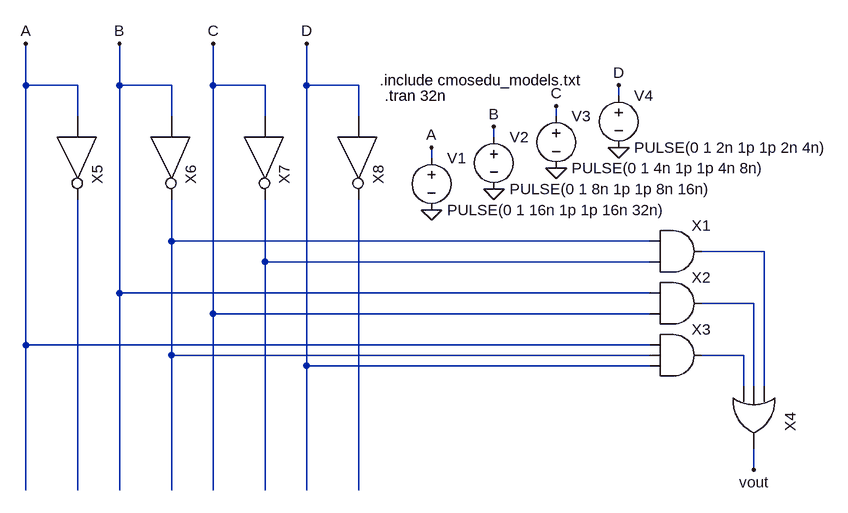
[diagram p0: schematic circuit.asc]
circuit.asc, the LTspice schematic file:
Version 4
SHEET 1 1092 680
WIRE -528 -64 -528 -128
WIRE -448 -64 -528 -64
WIRE -384 -64 -384 -128
WIRE -304 -64 -384 -64
WIRE -240 -64 -240 -128
WIRE -160 -64 -240 -64
WIRE -96 -64 -96 -128
WIRE -16 -64 -96 -64
WIRE 384 -48 384 -64
WIRE -448 -16 -448 -64
WIRE -304 -16 -304 -64
WIRE -160 -16 -160 -64
WIRE -16 -16 -16 -64
WIRE 288 -16 288 -32
WIRE 192 16 192 0
WIRE 96 48 96 32
WIRE -304 176 -304 112
WIRE 432 176 -304 176
WIRE 608 192 512 192
WIRE -160 208 -160 112
WIRE 432 208 -160 208
WIRE -384 256 -384 -64
WIRE 432 256 -384 256
WIRE 592 272 512 272
WIRE -240 288 -240 -64
WIRE 432 288 -240 288
WIRE -528 336 -528 -64
WIRE 432 336 -528 336
WIRE -304 352 -304 176
WIRE 432 352 -304 352
WIRE 576 352 512 352
WIRE -96 368 -96 -64
WIRE 432 368 -96 368
WIRE 576 400 576 352
WIRE 592 400 592 272
WIRE 608 400 608 192
WIRE 592 528 592 496
WIRE -528 560 -528 336
WIRE -448 560 -448 112
WIRE -384 560 -384 256
WIRE -304 560 -304 352
WIRE -240 560 -240 288
WIRE -160 560 -160 208
WIRE -96 560 -96 368
WIRE -16 560 -16 112
FLAG 192 96 0
FLAG 96 128 0
FLAG 288 64 0
FLAG 384 32 0
FLAG 96 32 A
FLAG 192 0 B
FLAG 288 -32 C
FLAG 384 -64 D
FLAG 592 528 vout
FLAG -528 -128 A
FLAG -384 -128 B
FLAG -240 -128 C
FLAG -96 -128 D
SYMBOL AND3 480 288 R0
SYMATTR InstName X3
SYMBOL voltage 96 32 R0
WINDOW 123 0 0 Left 0
WINDOW 39 0 0 Left 0
SYMATTR InstName V1
SYMATTR Value PULSE(0 1 16n 1p 1p 16n 32n)
SYMBOL voltage 192 0 R0
WINDOW 123 0 0 Left 0
WINDOW 39 0 0 Left 0
SYMATTR InstName V2
SYMATTR Value PULSE(0 1 8n 1p 1p 8n 16n)
SYMBOL voltage 288 -32 R0
WINDOW 123 0 0 Left 0
WINDOW 39 0 0 Left 0
SYMATTR InstName V3
SYMATTR Value PULSE(0 1 4n 1p 1p 4n 8n)
SYMBOL voltage 384 -64 R0
WINDOW 123 0 0 Left 0
WINDOW 39 0 0 Left 0
SYMATTR InstName V4
SYMATTR Value PULSE(0 1 2n 1p 1p 2n 4n)
SYMBOL OR3 656 448 R90
SYMATTR InstName X4
SYMBOL NOT -416 16 R90
SYMATTR InstName X5
SYMBOL NOT -272 16 R90
SYMATTR InstName X6
SYMBOL NOT -128 16 R90
SYMATTR InstName X7
SYMBOL NOT 16 16 R90
SYMATTR InstName X8
SYMBOL AND2 480 128 R0
SYMATTR InstName X1
SYMBOL AND2 480 208 R0
SYMATTR InstName X2
TEXT 16 -72 Left 2 !.include cmosedu_models.txt
TEXT 24 -48 Left 2 !.tran 32n

The netlist it stands for:
* circuit.asc
XX3 A D N005 N001 AND3  ; pins In1 In3 Out In2
V1 A 0 PULSE(0 1 16n 1p 1p 16n 32n)
V2 B 0 PULSE(0 1 8n 1p 1p 8n 16n)
V3 C 0 PULSE(0 1 4n 1p 1p 4n 8n)
V4 D 0 PULSE(0 1 2n 1p 1p 2n 4n)
XX4 N002 N004 N005 vout OR3  ; pins In1 In2 In3 Out
XX5 A N006 NOT  ; pins In Out
XX6 B N001 NOT  ; pins In Out
XX7 C N003 NOT  ; pins In Out
XX8 D N007 NOT  ; pins In Out
XX1 N001 N003 N002 AND2  ; pins In1 In2 Out
XX2 B C N004 AND2  ; pins In1 In2 Out
.include cmosedu_models.txt
.tran 32n
.backanno
.end

* Results of the author's LTspice run, read from the files saved beside the schematic
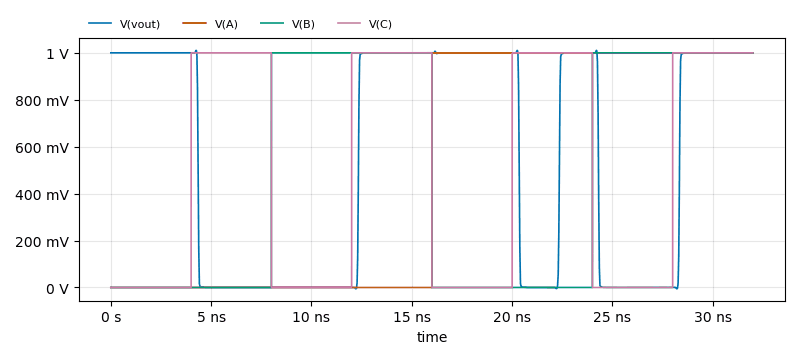
[diagram p1: Transient Analysis of circuit.asc, plotted from the saved traces]
* Transient Analysis, 1 run:
*   V(vout): min -5.674 mV, max 1.011 V, average 561.9 mV, rms 747.4 mV, last 1 V
*   V(A): min 0 V, max 1 V, average 500 mV, rms 707.1 mV, last 1 V
*   V(B): min 0 V, max 1 V, average 500 mV, rms 707.1 mV, last 1 V
*   V(C): min 0 V, max 1 V, average 500.1 mV, rms 707.1 mV, last 1 V